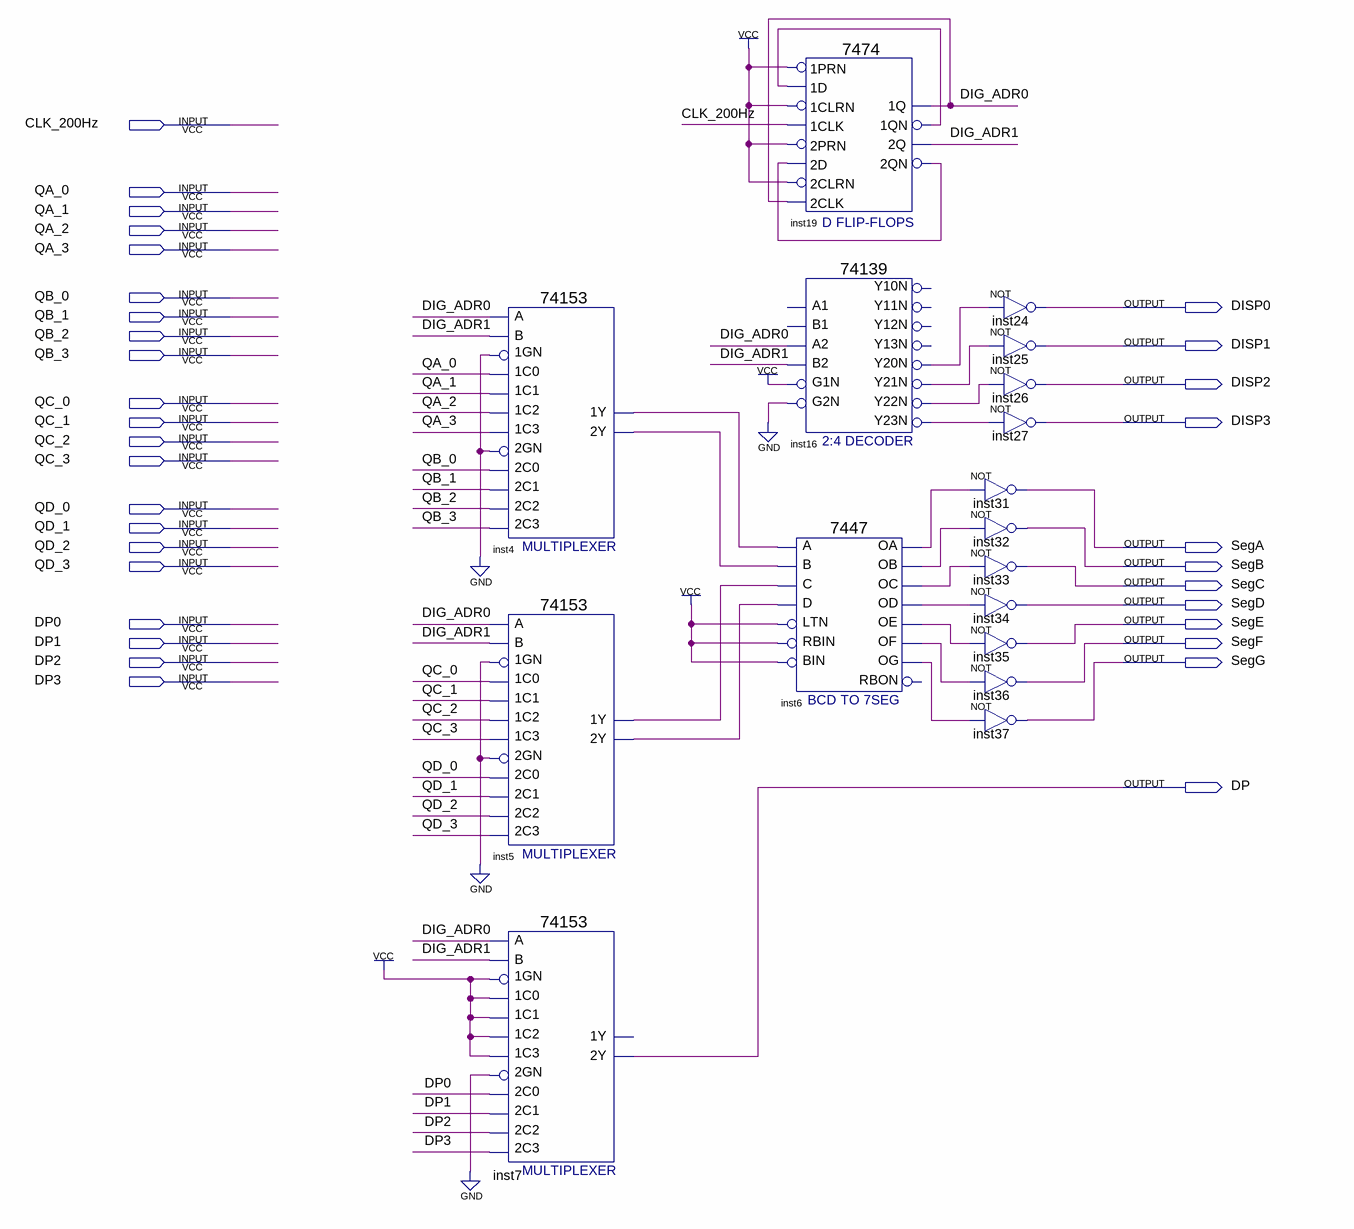
[diagram p0: schematic sheet]
// Quartus schematic MAXimator_7seg_4digs_7447_module.bdf as structural Verilog: 17 symbols, 33 pins
module MAXimator_7seg_4digs_7447_module (
  input  CLK_200Hz,
  input  QA_0,
  input  QA_1,
  input  QA_2,
  input  QA_3,
  input  QB_0,
  input  QB_1,
  input  QB_2,
  input  QB_3,
  input  QC_0,
  input  QC_1,
  input  QC_2,
  input  QC_3,
  input  QD_0,
  input  QD_1,
  input  QD_2,
  input  QD_3,
  input  DP0,
  input  DP1,
  input  DP2,
  input  DP3,
  output DISP0,
  output DISP1,
  output DISP2,
  output DISP3,
  output SegA,
  output SegB,
  output SegC,
  output SegD,
  output SegE,
  output SegF,
  output SegG,
  output DP
);

  wire DIG_ADR0, DIG_ADR1, inst4_1y, inst4_2y, inst5_1y, inst5_2y, inst6_oa, inst6_ob, inst6_oc, inst6_od,
       inst6_oe, inst6_of, inst6_og, inst16_y20n, inst16_y21n, inst16_y22n, inst16_y23n, inst19_1qn,
       inst19_2qn;

  \74153  inst4 (
    .\1C1 (QA_1), .\1GN (1'b0), .\1C0 (QA_0), .\2C0 (QB_0), .\2GN (1'b0), .\2C2 (QB_2), .\1C2 (QA_2),
    .\1C3 (QA_3), .B(DIG_ADR1), .A(DIG_ADR0), .\2C1 (QB_1), .\2C3 (QB_3), .\1Y (inst4_1y), .\2Y (inst4_2y));
  \74153  inst5 (
    .\1C1 (QC_1), .\1GN (1'b0), .\1C0 (QC_0), .\2C0 (QD_0), .\2GN (1'b0), .\2C2 (QD_2), .\1C2 (QC_2),
    .\1C3 (QC_3), .B(DIG_ADR1), .A(DIG_ADR0), .\2C1 (QD_1), .\2C3 (QD_3), .\1Y (inst5_1y), .\2Y (inst5_2y));
  \74153  inst7 (
    .\1C1 (1'b1), .\1GN (1'b1), .\1C0 (1'b1), .\2C0 (DP0), .\2GN (1'b0), .\2C2 (DP2), .\1C2 (1'b1),
    .\1C3 (1'b1), .B(DIG_ADR1), .A(DIG_ADR0), .\2C1 (DP1), .\2C3 (DP3), .\2Y (DP));  // open: 1Y
  \7447  inst6 (
    .LTN(1'b1), .B(inst4_2y), .C(inst5_1y), .D(inst5_2y), .RBIN(1'b1), .BIN(1'b1), .A(inst4_1y),
    .OB(inst6_ob), .OC(inst6_oc), .OE(inst6_oe), .OD(inst6_od), .OF(inst6_of), .OG(inst6_og), .OA(inst6_oa));  // open: RBON
  \7474  inst19 (
    .\2D (inst19_2qn), .\2PRN (1'b1), .\1CLK (CLK_200Hz), .\1D (inst19_1qn), .\1PRN (1'b1),
    .\2CLK (DIG_ADR0), .\2CLRN (1'b1), .\1CLRN (1'b1), .\1QN (inst19_1qn), .\2Q (DIG_ADR1),
    .\2QN (inst19_2qn), .\1Q (DIG_ADR0));
  \74139  inst16 (
    .A2(DIG_ADR0), .B2(DIG_ADR1), .G1N(1'b1), .G2N(1'b0), .Y20N(inst16_y20n), .Y21N(inst16_y21n),
    .Y22N(inst16_y22n), .Y23N(inst16_y23n));  // open: A1, B1, Y10N, Y13N, Y12N, Y11N
  not inst24 (DISP0, inst16_y20n);
  not inst25 (DISP1, inst16_y21n);
  not inst26 (DISP2, inst16_y22n);
  not inst27 (DISP3, inst16_y23n);
  not inst31 (SegA, inst6_oa);
  not inst32 (SegB, inst6_ob);
  not inst33 (SegC, inst6_oc);
  not inst34 (SegD, inst6_od);
  not inst35 (SegE, inst6_oe);
  not inst36 (SegF, inst6_of);
  not inst37 (SegG, inst6_og);
endmodule
